# Altium schematic sheet 美安微波红外-芯海-V1.5.SCHDOC
size C
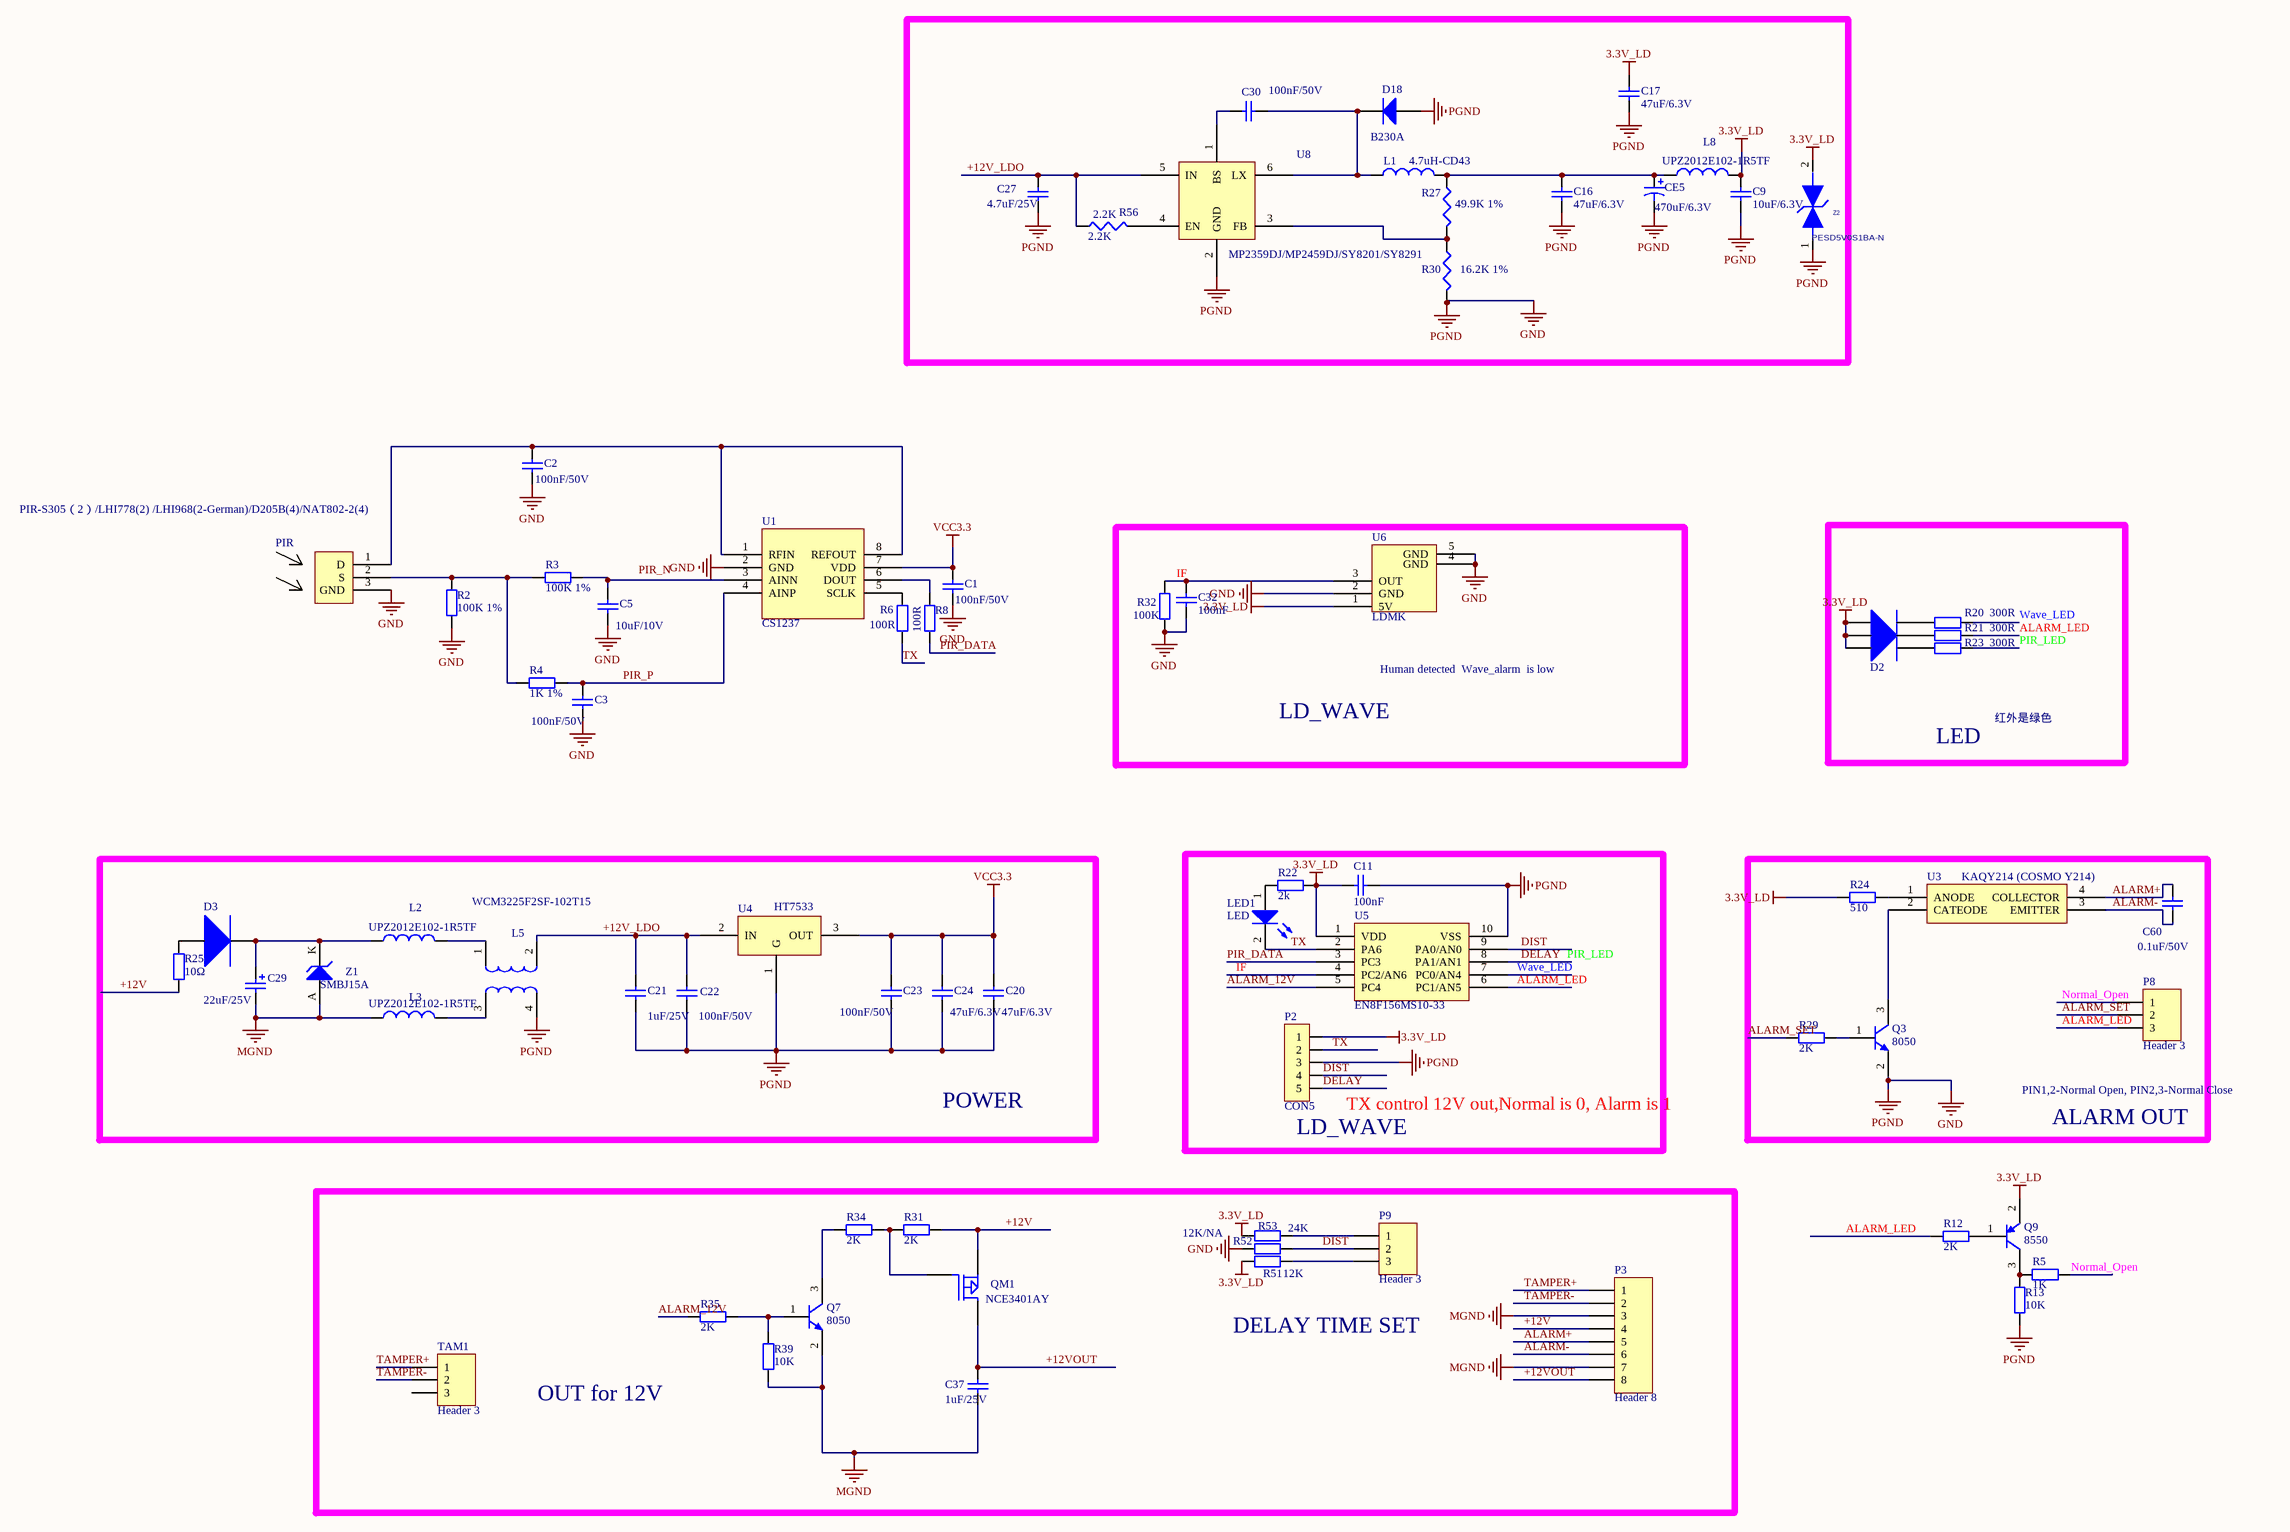
[diagram p0: 美安微波红外-芯海-V1.5.SCHDOC]

## Parts
C1  100nF/50V  [0603]
C2  100nF/50V  [0603]
C3  100nF/50V  [0603]
C5  10uF/10V  [C0805]
C9  10uF/6.3V  [0603]
C11  100nF  [0603]
C16  47uF/6.3V  [0805]
C17  47uF/6.3V  [0805]
C20  47uF/6.3V  [C0805]
C21  1uF/25V  [C0805]
C22  100nF/50V  [C0603]
C23  100nF/50V  [C0603]
C24  47uF/6.3V  [C0805]
C27  4.7uF/25V  [0805]
C29  22uF/25V  [CAP5.0X5.4]
C30  100nF/50V  [0603]
C32  100nF  [0603]
C37  1uF/25V  [C0805]
C60  0.1uF/50V  [C0603]
CE5  470uF/6.3V  [CAP6.3X5.4]
D2  led三色共阴极灯  [三色灯]  (value not drawn)
D3  SS14  [SS14]  (value not drawn)
D18  B230A  [SMA]
L1  4.7uH-CD43  [CDRH3D16]
L2  UPZ2012E102-1R5TF  [R0805]
L3  UPZ2012E102-1R5TF  [R0805]
L5  WCM3225F2SF-102T15  [CMC-3225]
L8  UPZ2012E102-1R5TF  [R0805]
LED1  LED  [LED-0603]
P2  CON5  [PH2.0-5P]
P3  Header 8  [5.08dip-8]
P8  Header 3  [HDR1X3]
P9  Header 3  [HDR1X3]
PIR  PIR-S305（2）/LHI778(2) /LHI968(2-German)/D205B(4)/NAT802-2(4)  [pir3]
Q3  8050  [8050&8550]
Q7  8050  [8050&8550]
Q9  8550  [8050&8550]
QM1  NCE3401AY  [SOT-23]
R2  100K 1%  [R0603]
R3  100K 1%  [R0603]
R4  1K 1%  [R0603]
R5  1K  [R0603]
R6  100R  [R0603]
R8  100R  [R0603]
R12  2K  [R0603]
R13  10K  [R0603]
R20  value 300R  [R0603]  (hidden comment: Res2)
R21  value 300R  [R0603]  (hidden comment: Res2)
R22  value 2k  [R0603]  (hidden comment: Res2)
R23  value 300R  [R0603]  (hidden comment: Res2)
R24  510  [R0603]
R25  10Ω  [C0805]
R27  49.9K 1%  [0603]
R29  2K  [R0603]
R30  16.2K 1%  [0603]
R31  2K  [R0603]
R32  100K  [R0603]
R34  2K  [R0603]
R35  2K  [R0603]
R39  10K  [R0603]
R51  12K  [R0603]
R52  12K/NA  [R0603]
R53  24K  [R0603]
R56  2.2K  [0603]
TAM1  Header 3  [KW12]
U1  CS1237  [SOP_8]
U3  value KAQY214 (COSMO Y214)  [TLP627]  (hidden comment: TLP627)
U4  HT7533  [SOT-89]
U5  EN8F156MS10-33  [MSOP10-0.5]
U6  LDMK  [LDMK]
U8  MP2359DJ/MP2459DJ/SY8201/SY8291  [SOT23-6]
Z1  SMBJ15A  [SMB]
Z2  PESD5V0S1BA-N  [SOD-323]

## Blocks framed on the sheet
LD_WAVE: C32 R32 U6
LED: D2 R20 R21 R23
POWER: C20-C24 C29 D3 L2 L3 L5 R25 U4 Z1
LD_WAVE: C11 LED1 P2 R22 U5
ALARM OUT: C60 P8 Q3 R24 R29 U3

## Nets
3.3V_LD: C9.1 C11.2 C17.1 D2.1(A+) D2.2(B+) D2.3(C+) L8.1 P2.1 Q9.2(E) R22.1 R24.2 R51.2 R53.2 U5.1(VDD) U6.1(5V) Z2.2
GND: C1.1 C2.1 C3.1 C5.1 C9.2 C11.1 C16.2 C17.2 C20.1 C21.1 C22.1 C23.1 C24.1 C27.2 C32.1 CE5.2 D18.1(A) L5.4 P2.3 PIR.3(GND) Q3.2(E) R2.1 R13.2 R30.2 R32.1 R52.2 U1.2(GND) U4.1(G) U5.10(VSS) U6.2(GND) U6.4(GND) U6.5(GND) U8.2(GND) Z2.1  [also labelled PGND]
MGND: C29.2 C37.1 L3.2 P3.3 P3.7 Q7.2(E) R39.1 Z1.A
VCC3.3: C1.2 C20.2 C23.2 C24.2 U1.7(VDD) U4.3(OUT)
+12V: P3.4 QM1.2(S) R25.2 R31.2
+12V_LDO: C21.2 C22.2 C27.1 L5.2 R56.1 U4.2(IN) U8.5(IN)
+12VOUT: C37.2 P3.8 QM1.3(D)
ALARM+: C60.2 P3.5 U3.4(COLLECTOR)
ALARM-: C60.1 P3.6 U3.3(EMITTER)
ALARM_12V: R35.1 U5.5(PC4)
ALARM_LED: P8.3 R12.2 R21.1 U5.6(PC1/AN5)
ALARM_SET: P8.2 R29.1
DELAY: P2.5 R23.1 U5.8(PA1/AN1)  [also labelled PIR_LED]
DIST: P2.4 P9.2 R52.1 U5.9(PA0/AN0)
IF: C32.2 R32.2 U5.4(PC2/AN6) U6.3(OUT)
Normal_Open: P8.1 R5.2
PIR_DATA: R8.2 U5.3(PC3)
PIR_P: C3.2 R4.1 U1.4(AINP)
TAMPER+: P3.1 TAM1.1
TAMPER-: P3.2 TAM1.2
TX: LED1.2(K) P2.2 R6.2 U5.2(PA6)
Wave_LED: R20.1 U5.7(PC0/AN4)
NetC2_2: C2.2 PIR.1(D) U1.1(RFIN) U1.8(REFOUT)
NetC5_2: C5.2 R3.1 U1.3(AINN)
NetC16_1: C16.1 CE5.1 L1.2 L8.2 R27.1
NetC29_1: C29.1 D3.2(C) L2.2 Z1.K
NetC30_1: C30.1 D18.2(K) L1.1 U8.6(LX)
NetC30_2: C30.2 U8.1(BS)
NetD2_4: D2.4(A-) R20.2
NetD2_5: D2.5(B-) R21.2
NetD2_6: D2.6(C-) R23.2
NetD3_1: D3.1(B) R25.1
NetL2_1: L2.1 L5.1
NetL3_1: L3.1 L5.3
NetLED1_1: LED1.1(A) R22.2
NetP9_1: P9.1 R53.1
NetP9_3: P9.3 R51.1
NetPIR_2: PIR.2(S) R2.2 R3.2 R4.2
NetQ3_1: Q3.1(B) R29.2
NetQ3_3: Q3.3(C) U3.2(CATEODE)
NetQ7_1: Q7.1(B) R35.2 R39.2
NetQ7_3: Q7.3(C) R34.1
NetQ9_1: Q9.1(B) R12.1
NetQ9_3: Q9.3(C) R5.1 R13.1
NetQM1_1: QM1.1(G) R31.1 R34.2
NetR6_1: R6.1 U1.5(SCLK)
NetR8_1: R8.1 U1.6(DOUT)
NetR24_1: R24.1 U3.1(ANODE)
NetR27_2: R27.2 R30.1 U8.3(FB)
NetR56_2: R56.2 U8.4(EN)

Not connected (* = marked no-connect by the designer): TAM1 3

## Notes on the sheet
- Human detected  Wave_alarm  is low
- 红外是绿色
- PIN1,2-Normal Open, PIN2,3-Normal Close
- DELAY TIME SET
- OUT for 12V
- Labels drawn without touching a wire or pin: PIR_N, TX control 12V out,Normal is 0, Alarm is 1

## Library data of the parts
C1-C3 C5 C9 C11 C20-C24 C32 C37 C60 = Cap: Capacitor; Published: 8-Jun-2000; LatestRevisionDate: 17-Jul-2002; LatestRevisionNote: Re-released for DXP Platform.; PackageReference: RAD-0.3; Publisher: Altium Limited; PackageDescription: Radial Cap, Thru-Hole; 2 Leads; 0.3 in Pin Spacing
  C1-C3 C22 C23: Value: 100nF/50V
  C5: Value: 10uF/10V
  C9: Value: 10uF/6.3V
  C11 C32: Value: 100nF
  C20 C24: Value: 47uF/6.3V
  C21 C37: Value: 1uF/25V
  C60: Value: 0.1uF/50V
C16 C17 C27 C30 = Cap Semi: Capacitor (Semiconductor SIM Model); Published: 8-Jun-2000; LatestRevisionDate: 29-May-2009; LatestRevisionNote: IPC-7351 Footprint Added.; PackageReference: C1206; Publisher: Altium Limited; PackageDescription: Chip Capacitor
  C16 C17: Value: 47uF/6.3V
  C27: Value: 4.7uF/25V
  C30: Value: 100nF/50V
C29 = Cap Pol2: Polarized Capacitor (Axial); Published: 8-Jun-2000; LatestRevisionDate: 17-Jul-2002; LatestRevisionNote: Re-released for DXP Platform.; PackageReference: POLAR0.8; Publisher: Altium Limited; PackageDescription: Polarized Capacitor; 2 Leads; Value: 22uF/25V
CE5 = Cap Pol1: Polarized Capacitor (Radial); Published: 8-Jun-2000; LatestRevisionDate: 17-Jul-2002; LatestRevisionNote: Re-released for DXP Platform.; PackageReference: RB7.6-15; Publisher: Altium Limited; Value: 470uF/6.3V
D18 = Diode 1N4007: 1 Amp General Purpose Rectifier; Revision 1: 11-Jul-2000: SIM Model Added.; Revision 2: 17-Jul-2002: Re-released for DXP Platform.; Package Information: Latest Revision: Aug-1999; Code - JEDEC: DO-204-AL; Published: 8-Jun-2000; Datasheet: Latest Revision: 1998; Package Reference: DO-41; Publisher: Altium Limited; Value: B230A
L1-L3 L8 = Inductor: Code_IEC: 1005; Published: 8-Jun-2000; PackageReference: 0402-A; Publisher: Altium Limited; Code_JEITA: 0402
  L1: LatestRevisionDate: 17-Jul-2002; LatestRevisionNote: Re-released for DXP Platform.; Value: 4.7uH-CD43
  L2 L3 L8: LatestRevisionDate: 29-May-2009; LatestRevisionNote: IPC-7351 Footprint Added.; PackageDescription: Chip Inductor; Value: UPZ2012E102-1R5TF
L5 = Trans: Transformer; Published: 24-Mar-1999; LatestRevisionDate: 08-Jul-2005; LatestRevisionNote: Mech Layer 1 removed.; PackageReference: TRANS; Publisher: Altium Limited; PackageDescription: Transformer; 4 Leads; Value: WCM3225F2SF-102T15
LED1 = LED0: Published: 8-Jun-2000; LatestRevisionDate: 08-Jul-2005; LatestRevisionNote: Mech Layer 1 removed.; PackageReference: LED-0; Publisher: Altium Limited; PackageDescription: LED; 2 Leads; Value: LED
P2 = CON5: Connector
P3 = Header 8: Header, 8-Pin; LatestRevisionDate: 17-Jul-2002; LatestRevisionNote: Re-released for DXP Platform.; Publisher: Altium Limited
P8 P9 TAM1 = Header 3: Header, 3-Pin; LatestRevisionDate: 17-Jul-2002; LatestRevisionNote: Re-released for DXP Platform.; Publisher: Altium Limited
PIR = PIR
Q3 Q7 = 2N3904: NPN General Purpose Amplifier; Published: 8-Jun-2000; LatestRevisionDate: 15-Jan-2003; LatestRevisionNote: PCB Footprint 'BCY-W3/D4.7' replaced; DatasheetVersion: 1997; PackageVersion: Sep-1998; PackageReference: TO-92A; Publisher: Altium Limited; PackageDescription: TO, Flat Index; 3 In-Line, Axial Leads; Body Dia. 4.5mm; Leads 0.51 x 0.48 mm (max); ComponentLink1Description: Manufacturer Link; ComponentLink1URL: http://www.fairchildsemi.com/; ComponentLink2Description: Datasheet; ComponentLink2URL: http://www.fairchildsemi.com/ds/2N%2F2N3904.pdf; Value: 8050
Q9 = 2N3906: PNP General Purpose Amplifier; Published: 8-Jun-2000; LatestRevisionDate: 15-Jan-2003; LatestRevisionNote: PCB Footprint 'BCY-W3/D4.7' replaced; DatasheetVersion: 1997; PackageVersion: Sep-1998; PackageReference: TO-92A; Publisher: Altium Limited; PackageDescription: TO, Flat Index; 3 In-Line, Axial Leads; Body Dia. 4.5mm; Leads 0.51 x 0.48 mm (max); ComponentLink1Description: Manufacturer Link; ComponentLink1URL: http://www.fairchildsemi.com/; ComponentLink2Description: Datasheet; ComponentLink2URL: http://www.fairchildsemi.com/ds/2N%2F2N3906.pdf; Value: 8550
QM1 = MOSFET P: Value: NCE3401AY
R2-R6 R8 R12 R13 R20-R25 R29 R31 R32 R34 R35 R39 R51-R53 = Res2: Resistor; Published: 8-Jun-2000; LatestRevisionDate: 17-Jul-2002; LatestRevisionNote: Re-released for DXP Platform.; PackageReference: AXIAL-0.4; Publisher: Altium Limited
  R2 R3: PackageDescription: Axial Device, Thru-Hole; 2 Leads; 0.4 in Pin Spacing; Value: 100K 1%
  R4: PackageDescription: Axial Device, Thru-Hole; 2 Leads; 0.4 in Pin Spacing; Value: 1K 1%
  R5: PackageDescription: Axial Device, Thru-Hole; 2 Leads; 0.4 in Pin Spacing; Value: 1K
  R6 R8: PackageDescription: Axial Device, Thru-Hole; 2 Leads; 0.4 in Pin Spacing; Value: 100R
  R12: Value: 2K
  R13 R39: PackageDescription: Axial Device, Thru-Hole; 2 Leads; 0.4 in Pin Spacing; Value: 10K
  R20-R23: PackageDescription: Axial Device, Thru-Hole; 2 Leads; 0.4 in Pin Spacing
  R24: PackageDescription: Axial Device, Thru-Hole; 2 Leads; 0.4 in Pin Spacing; Value: 510
  R25: PackageDescription: Axial Device, Thru-Hole; 2 Leads; 0.4 in Pin Spacing; Value: 10Ω
  R29 R31 R34 R35: PackageDescription: Axial Device, Thru-Hole; 2 Leads; 0.4 in Pin Spacing; Value: 2K
  R32: PackageDescription: Axial Device, Thru-Hole; 2 Leads; 0.4 in Pin Spacing; Value: 100K
  R51: Value: 12K
  R52: Value: 12K/NA
  R53: Value: 24K
R27 R30 R56 = Res3: Resistor; Published: 8-Jun-2000; Revision: July-2002: Re-released for DXP Platform.; Publisher: Altium Limited
  R27: Value: 49.9K 1%
  R30: Value: 16.2K 1%
  R56: Value: 2.2K
U4 = 12S33: Value: HT7533
U8 = SY8120B: Value: MP2359DJ/MP2459DJ/SY8201/SY8291
Z1 = D Zener: Zener Diode; Published: 8-Jun-2000; LatestRevisionDate: 17-Jul-2002; LatestRevisionNote: Re-released for DXP Platform.; PackageReference: DIODE-0.7; Publisher: Altium Limited; PackageDescription: Diode, Thru-Hole; 2 Leads; 0.7 in Pin Spacing
Z2 = ESD-PESD5V0S1BL-VMN2: VBR=5.780V@1mA;VRWM=3.5V@IRWM=0.5uA;Ct=30pF; MFR: NXP; MPN: RSB6.8CS//VMNZ6.8CST2R  //PESD5V0S1BL//ESDALC6V1-1BM2//ESD9B5.0ST5G//VMNZ6.8CSGJT2R//RSB6.8CM; Geometry.Height: 0.4MM; PCB Footprint: VMN2; SN: 40300009; TYPE: 双向ESD保护二极管; Value: PESD5V0S1BA-N; PCB DECAL: VMN2
D3 = SS14: Value: SS14